# EAGLE schematic Vinduino-GW-29-2-16 (EAGLE 7.5.0)
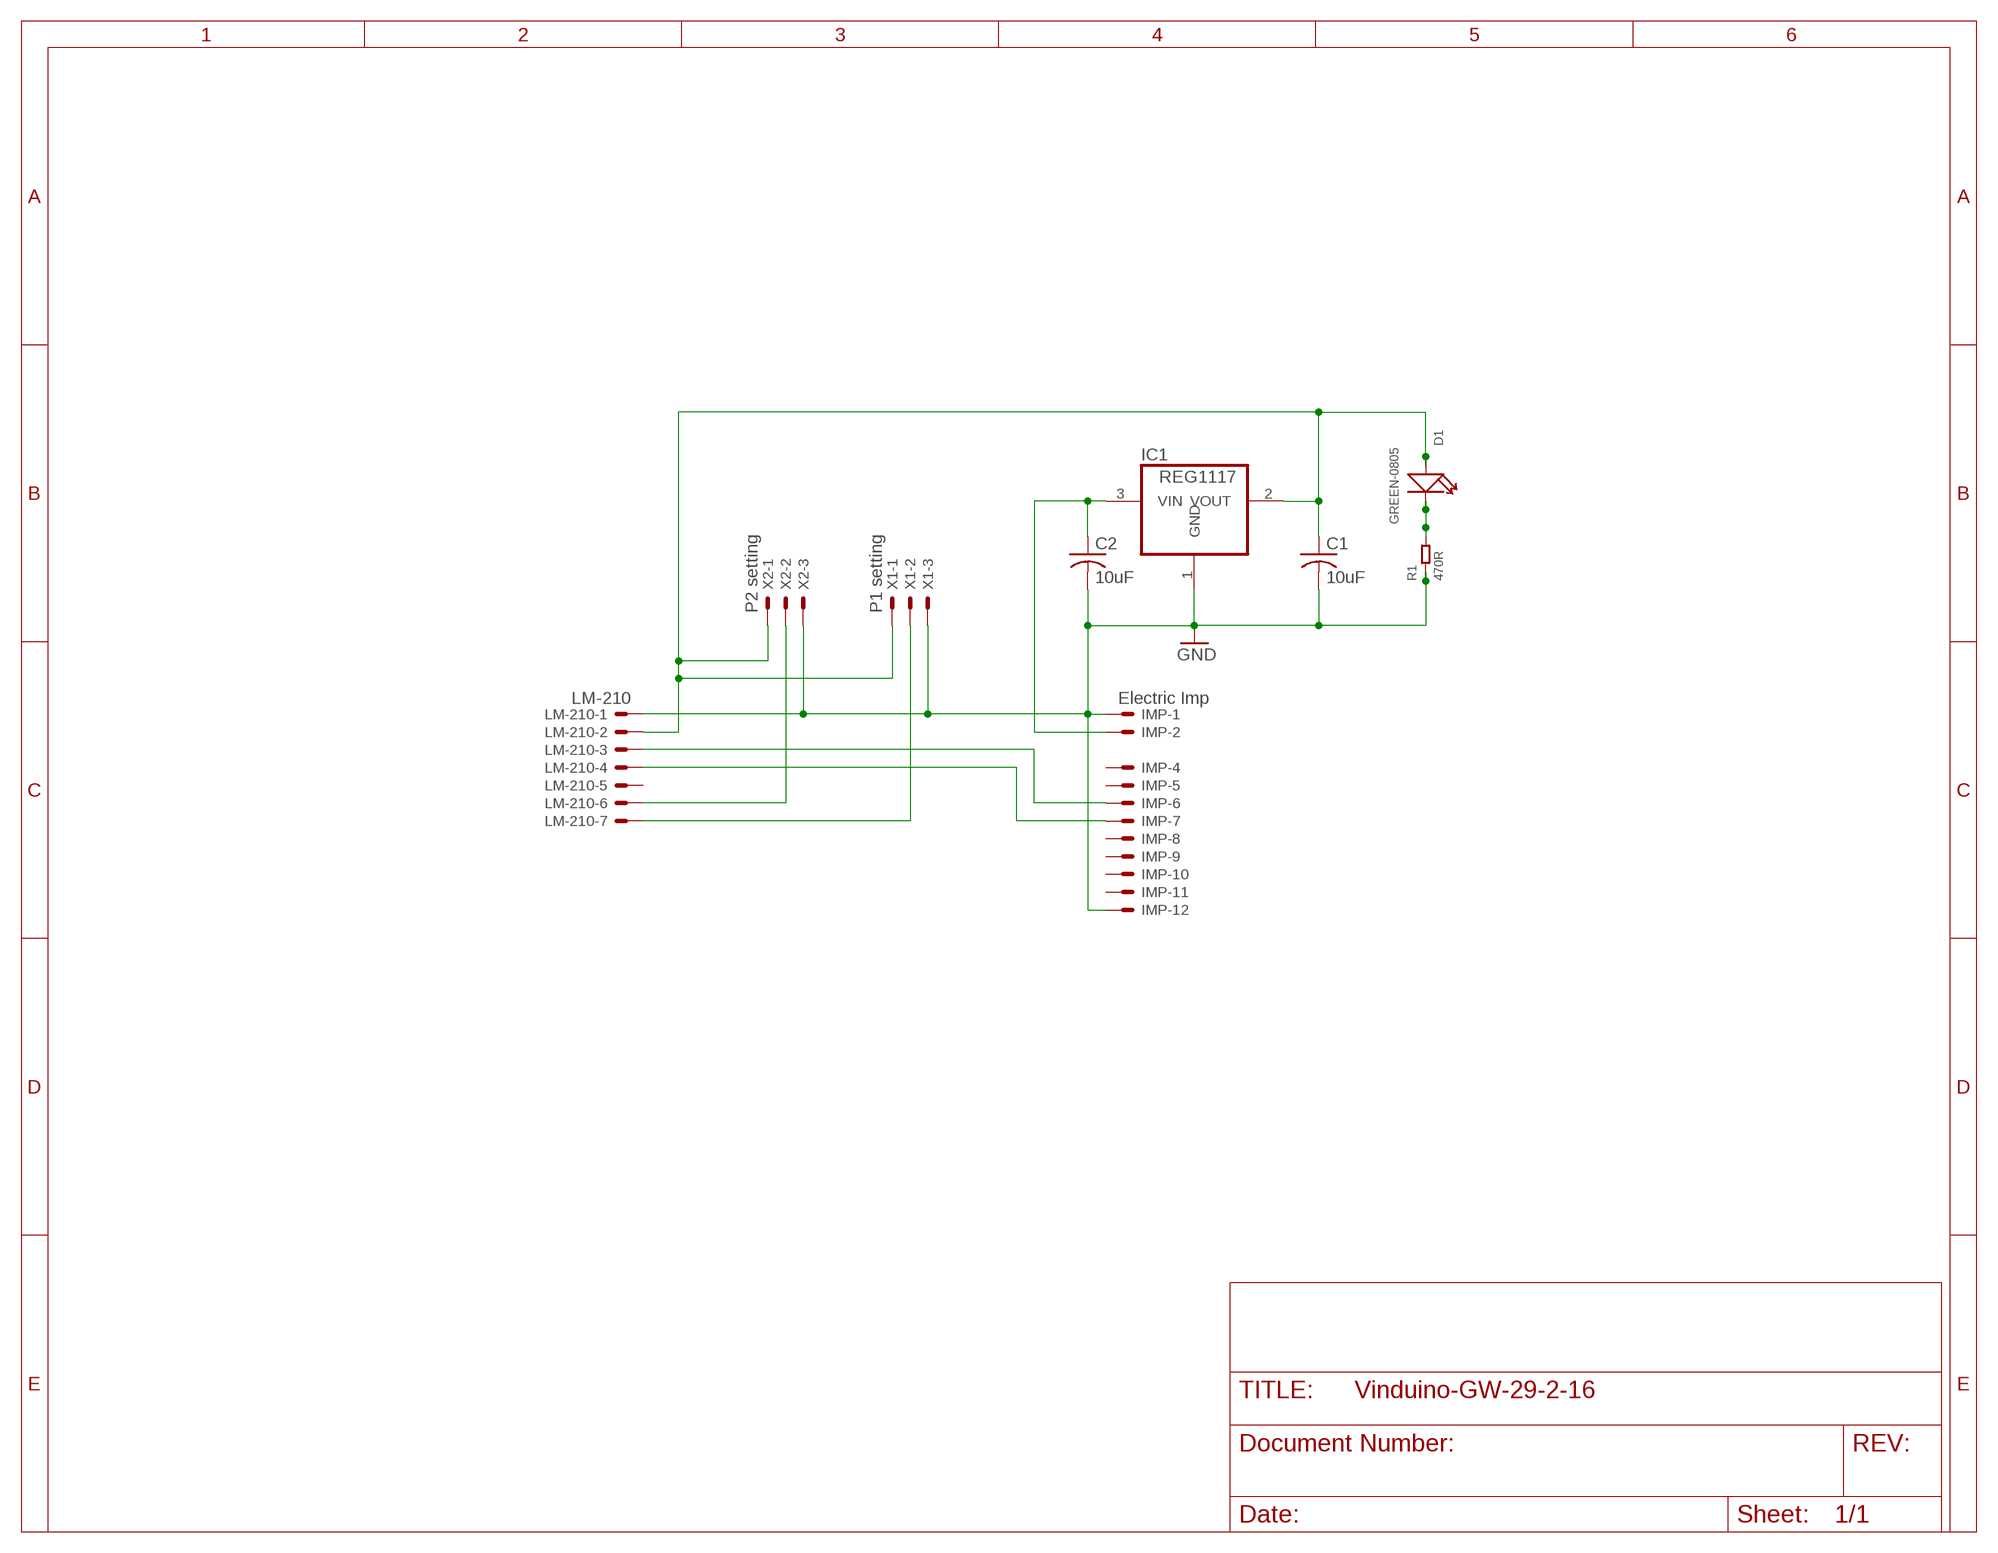
[diagram p0: schematic, sheet 1]

## Parts
C1  10uF  C-US025-030X050  [C025-030X050]
C2  10uF  C-US025-030X050  [C025-030X050]
D1  GREEN-0805  SMD-LED-CLEAR-GREEN(0805)  [LED-0805]
IC1  REG1117  [SOT223]
IMP  Electric Imp  22-23-2121  [22-23-2121]
LM-210  LM-210  22-23-2071  [22-23-2071]
R1  470R  SMD-RES-470R-1%-1/8W(0805)  [R0805]
X1  P1 setting  22-23-2031  [22-23-2031]
X2  P2 setting  22-23-2031  [22-23-2031]

## Nets
GND [Supply]: C1.2 C2.2 IC1.1(GND) IMP.1 IMP.12 LM-210.1 R1.1 X1.3 X2.3
N$1 [Supply]: C2.1 IC1.3(VIN) IMP.2
N$2: LM-210.6 X2.2
N$3: LM-210.7 X1.2
N$4: IMP.6 LM-210.3
N$5: IMP.7 LM-210.4
N$7: D1.- R1.2
N$26 [Supply]: C1.1 D1.+ IC1.2(VOUT) LM-210.2 X1.1 X2.1
Unconnected: IMP.3 IMP.4 IMP.5 IMP.8 IMP.9 IMP.10 IMP.11 LM-210.5

## Library data of the parts
C1 C2 = adafruit:C-US: CAPACITOR, American symbol
D1 = Seeed-OPL-Diode:SMD-LED-CLEAR-GREEN(0805): 304090057; MPN: 17-215SYGC/S530-E2/TR8
IC1 = burr-brown:REG1117: 800mA and 1A Low Dropout (LDO) Positive Regulator 1.8V, 2.5V, 2.85V, 3.3V, 5V, and Adj; MPN: REG1117; OC_FARNELL: 1097566; OC_NEWARK: 14P6981
IMP = con-molex:22-23-2121: .100" (2.54mm) Center Header - 12 Pin; MF: MOLEX; MPN: 22-23-2121; OC_FARNELL: 1462935; OC_NEWARK: 56H0456
LM-210 = con-molex:22-23-2071: .100" (2.54mm) Center Header - 7 Pin; MF: MOLEX; MPN: 22-23-2071; OC_FARNELL: 1654534; OC_NEWARK: 56H0445
R1 = Seeed-OPL-Resistor:SMD-RES-470R-1%-1/8W(0805): 301010367; MPN: RC0805FR-07470RL
X1 X2 = con-molex:22-23-2031: .100" (2.54mm) Center Header - 3 Pin; MF: MOLEX; MPN: 22-23-2031; OC_FARNELL: 1462950; OC_NEWARK: 30C0862

## Net classes
0 default: width 0.254 mm, clearance 0.205 mm
1 Supply: width 0.508 mm, clearance 0.508 mm